# Altium schematic sheet 8_MGTBank.SchDoc: MGT Configuration
size A; Date: 12/29/25; Author: Praveen Perera; DrawnBy: Praveen Perera; Engineer: Praveen Perera; Revision: 0; SheetNumber: 8; SheetTotal: 9
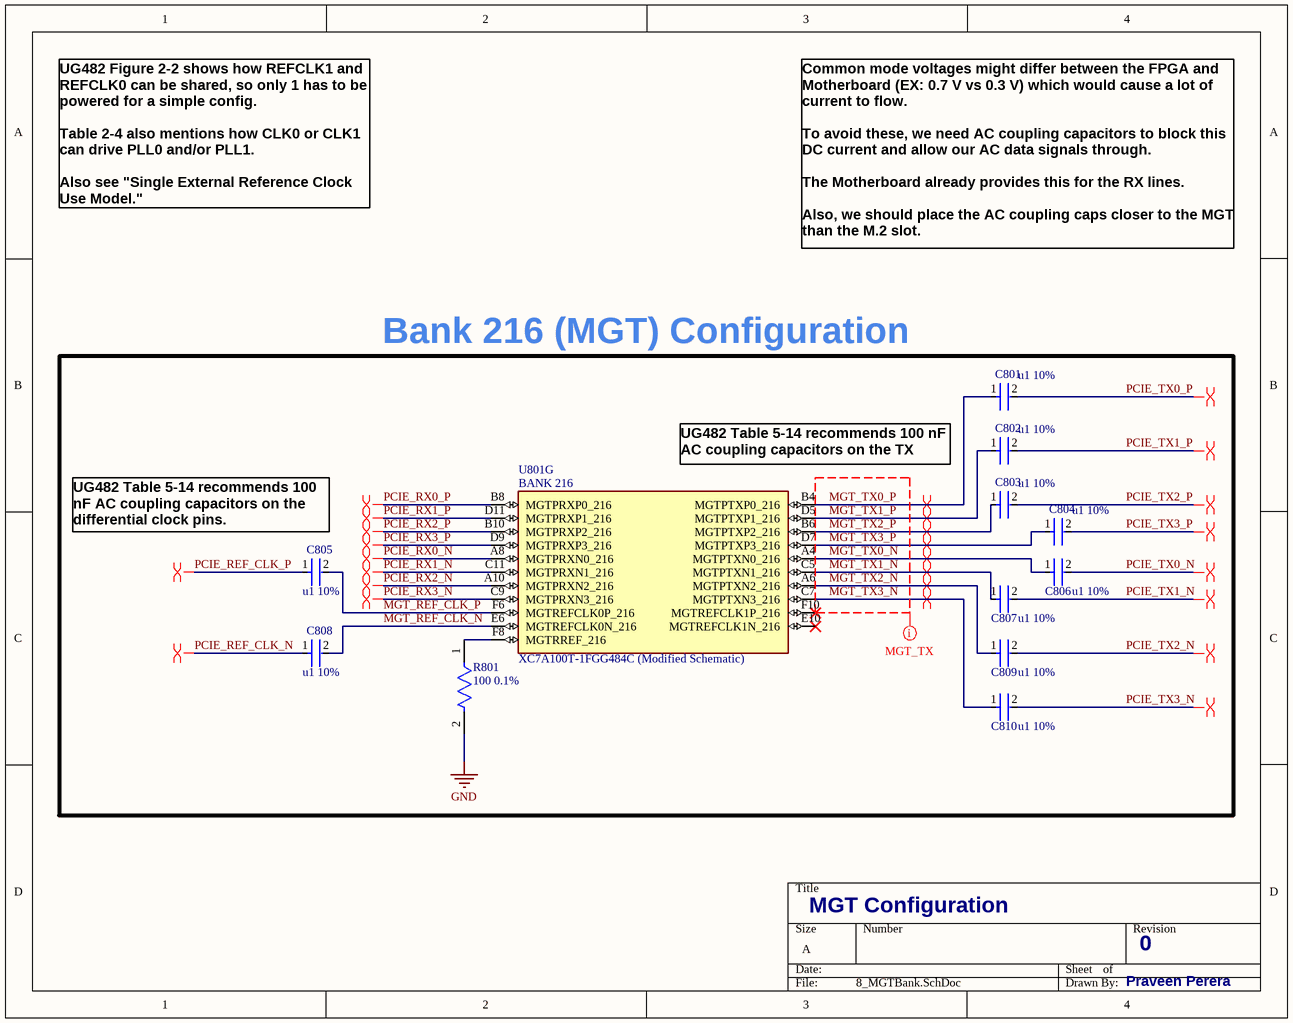
[diagram p0: 8_MGTBank.SchDoc]

## Parts
C801  u1 10%  [FP-CL891-IPC_C]
C802  u1 10%  [FP-CL891-IPC_C]
C803  u1 10%  [FP-CL891-IPC_C]
C804  u1 10%  [FP-CL891-IPC_C]
C805  u1 10%  [FP-CL891-IPC_C]
C806  u1 10%  [FP-CL891-IPC_C]
C807  u1 10%  [FP-CL891-IPC_C]
C808  u1 10%  [FP-CL891-IPC_C]
C809  u1 10%  [FP-CL891-IPC_C]
C810  u1 10%  [FP-CL891-IPC_C]
R801  100 0.1%  [FP-ERA1A-IPC_B]
U801  XC7A100T-1FGG484C (Modified Schematic)  [BGA484C100P22X22_2300X2300X260N]  (part G of 14)

## Nets
GND: R801.2
MGT_REF_CLK_N: C808.2 U801.E6(MGTREFCLK0N_216)
MGT_REF_CLK_P: C805.2 U801.F6(MGTREFCLK0P_216)
MGT_TX0_N: C806.1 U801.A4(MGTPTXN0_216)
MGT_TX0_P: C801.1 U801.B4(MGTPTXP0_216)
MGT_TX1_N: C807.1 U801.C5(MGTPTXN1_216)
MGT_TX1_P: C802.1 U801.D5(MGTPTXP1_216)
MGT_TX2_N: C809.1 U801.A6(MGTPTXN2_216)
MGT_TX2_P: C803.1 U801.B6(MGTPTXP2_216)
MGT_TX3_N: C810.1 U801.C7(MGTPTXN3_216)
MGT_TX3_P: C804.1 U801.D7(MGTPTXP3_216)
PCIE_REF_CLK_N: C808.1
PCIE_REF_CLK_P: C805.1
PCIE_RX0_N: U801.A8(MGTPRXN0_216)
PCIE_RX0_P: U801.B8(MGTPRXP0_216)
PCIE_RX1_N: U801.C11(MGTPRXN1_216)
PCIE_RX1_P: U801.D11(MGTPRXP1_216)
PCIE_RX2_N: U801.A10(MGTPRXN2_216)
PCIE_RX2_P: U801.B10(MGTPRXP2_216)
PCIE_RX3_N: U801.C9(MGTPRXN3_216)
PCIE_RX3_P: U801.D9(MGTPRXP3_216)
PCIE_TX0_N: C806.2
PCIE_TX0_P: C801.2
PCIE_TX1_N: C807.2
PCIE_TX1_P: C802.2
PCIE_TX2_N: C809.2
PCIE_TX2_P: C803.2
PCIE_TX3_N: C810.2
PCIE_TX3_P: C804.2
NetR801_1: R801.1 U801.F8(MGTRREF_216)

Not connected (* = marked no-connect by the designer): U801 E10(MGTREFCLK1N_216)* F10(MGTREFCLK1P_216)*

## Layout directives
differential pair: MGT_TX0_N, MGT_TX0_P, MGT_TX1_N, MGT_TX1_P, MGT_TX2_N, MGT_TX2_P, MGT_TX3_N, MGT_TX3_P, PCIE_REF_CLK_N, PCIE_REF_CLK_P, PCIE_RX0_N, PCIE_RX0_P, PCIE_RX1_N, PCIE_RX1_P, PCIE_RX2_N, PCIE_RX2_P, PCIE_RX3_N, PCIE_RX3_P, PCIE_TX0_N, PCIE_TX0_P, PCIE_TX1_N, PCIE_TX1_P, PCIE_TX2_N, PCIE_TX2_P, PCIE_TX3_N, PCIE_TX3_P
mark named MGT_TX: MGT_TX0_N, MGT_TX0_P, MGT_TX1_N, MGT_TX1_P, MGT_TX2_N, MGT_TX2_P, MGT_TX3_N, MGT_TX3_P

## Notes on the sheet
- UG482 Figure 2-2 shows how REFCLK1 and REFCLK0 can be shared, so only 1 has to be powered for a simple config.
  Table 2-4 also mentions how CLK0 or CLK1 can drive PLL0 and/or PLL1.
  Also see "Single External Reference Clock Use Model."
- Common mode voltages might differ between the FPGA and Motherboard (EX: 0.7 V vs 0.3 V) which would cause a lot of current to flow.
  To avoid these, we need AC coupling capacitors to block this DC current and allow our AC data signals through.
  The Motherboard already provides this for the RX lines.
  Also, we should place the AC coupling caps closer to the MGT than the M.2 slot.
- (near C801) Bank 216 (MGT) Configuration
- UG482 Table 5-14 recommends 100 nF AC coupling capacitors on the TX pins.
- (near C805) UG482 Table 5-14 recommends 100 nF AC coupling capacitors on the differential clock pins.
- (in symbol CMP-002-000007-2, part G) BANK 216

## Library data of the parts
C801-C810 = CMP-13271-001945-1: CL05B104KB5NNNC / Cap Ceramic 100nF 50V X7R ±10% SMD 0402 +125°C Paper T/R
R801 = CMP-05422-000095-1: ERA-1AEB101C / RES SMD 100 OHM 0.1% 1/20W 0201; Max Power Dissipation: 50mW; Resistance: 100R; Temperature Coefficient: 25ppm/°C; Lead Free: Lead Free; Width: 0.012inch; Max Operating Temperature: 155°C; Features: Automotive AEC-Q200; Packaging: Tape and Reel; Length: 0.024inch; Number of Terminations: 2; Case Code (Imperial): 0201; Case/Package: 0201; Case Code (Metric): 0603; Tolerance: 0.1%; Min Operating Temperature: -55°C; Height: 0.009inch; Resistor Type: Thin Film
U801 = CMP-002-000007-2: Artix-7 Field Programmable Gate Array (FPGA) IC 285 4976640 101440 484-BBGA; MF: Xilinx Inc.; Check_prices: https://www.snapeda.com/parts/XC7A100T-1FGG484C/Xilinx/view-part/?ref=eda; Source: XC7A100T-1FGG484C - Modified.SchLib; MP: XC7A100T-1FGG484C; Pin Count: 484; Package: FBGA-484 Xilinx; Component Type: Standard; SnapEDA_Link: https://www.snapeda.com/parts/XC7A100T-1FGG484C/Xilinx/view-part/?ref=snap; Design Item ID: XC7A100T-1FGG484C; Value: *